# Altium schematic sheet IOT_Current_Sensor.SchDoc
size A
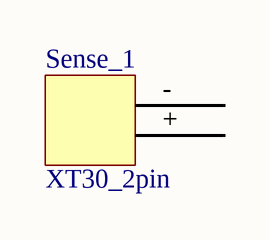
[diagram p0: IOT_Current_Sensor.SchDoc]

## Parts
Sense_1  XT30_2pin  [XT30_2pin]

## Nets

Not connected (* = marked no-connect by the designer): Sense_1 + -